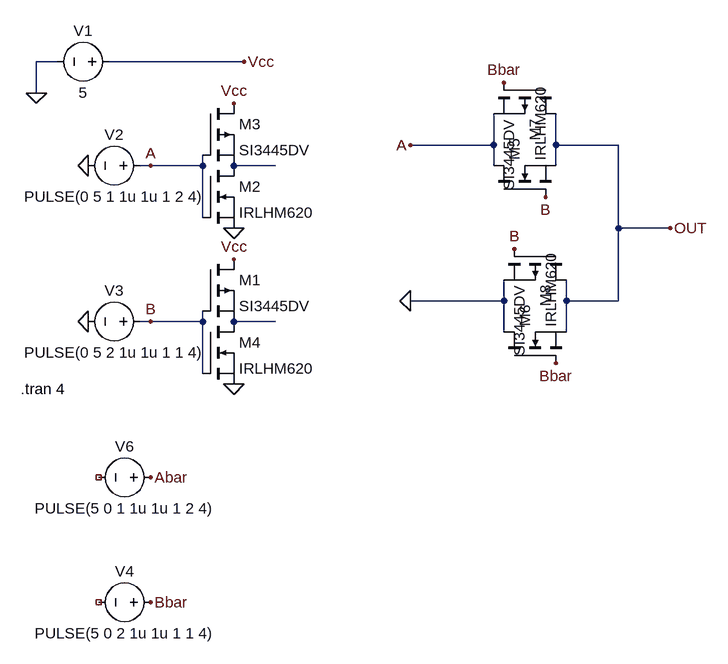
[diagram p0: schematic AND TG.asc]
AND TG.asc, the LTspice schematic file:
Version 4.1
SHEET 1 1444 880
WIRE -128 -16 -160 -16
WIRE 160 -16 -48 -16
WIRE -160 32 -160 -16
WIRE 544 112 544 64
WIRE 544 112 416 112
WIRE 640 112 640 64
WIRE 736 112 640 112
WIRE 16 144 0 144
WIRE 96 144 96 128
WIRE 96 144 16 144
WIRE 208 144 144 144
WIRE 544 144 544 112
WIRE 640 144 640 112
WIRE 96 224 96 144
WIRE 736 240 736 112
WIRE 816 240 736 240
WIRE 560 352 560 320
WIRE 560 352 416 352
WIRE 656 352 656 320
WIRE 736 352 736 240
WIRE 736 352 656 352
WIRE 16 384 0 384
WIRE 96 384 96 368
WIRE 96 384 16 384
WIRE 208 384 144 384
WIRE 560 400 560 352
WIRE 656 400 656 352
WIRE 96 464 96 384
FLAG -160 32 0
FLAG 160 -16 Vcc
FLAG -80 144 0
FLAG -80 384 0
FLAG 144 48 Vcc
FLAG 144 240 0
FLAG 16 144 A
FLAG 16 384 B
FLAG 144 288 Vcc
FLAG 144 480 0
FLAG 16 624 Abar
FLAG 16 816 Bbar
FLAG 560 16 Bbar
FLAG 640 448 Bbar
FLAG 624 192 B
FLAG 576 272 B
FLAG 416 352 0
FLAG 416 112 A
FLAG 816 240 OUT
SYMBOL voltage -32 -16 R90
WINDOW 0 -32 56 VBottom 2
WINDOW 3 32 56 VTop 2
WINDOW 123 0 0 Left 0
WINDOW 39 0 0 Left 0
SYMATTR InstName V1
SYMATTR Value 5
SYMBOL voltage 16 144 R90
WINDOW 0 -32 56 VBottom 2
WINDOW 3 32 56 VTop 2
WINDOW 123 0 0 Left 0
WINDOW 39 0 0 Left 0
SYMATTR InstName V2
SYMATTR Value PULSE(0 5 1 1u 1u 1 2 4)
SYMBOL voltage 16 384 R90
WINDOW 0 -32 56 VBottom 2
WINDOW 3 32 56 VTop 2
WINDOW 123 0 0 Left 0
WINDOW 39 0 0 Left 0
SYMATTR InstName V3
SYMATTR Value PULSE(0 5 2 1u 1u 1 1 4)
SYMBOL pmos 96 48 R0
SYMATTR InstName M3
SYMATTR Value SI3445DV
SYMBOL nmos 96 144 R0
SYMATTR InstName M2
SYMATTR Value IRLHM620
SYMBOL pmos 96 288 R0
SYMATTR InstName M1
SYMATTR Value SI3445DV
SYMBOL nmos 96 384 R0
SYMATTR InstName M4
SYMATTR Value IRLHM620
SYMBOL nmos 544 192 R270
SYMATTR InstName M5
SYMATTR Value IRLHM620
SYMBOL nmos 560 448 R270
SYMATTR InstName M6
SYMATTR Value IRLHM620
SYMBOL pmos 640 16 R90
SYMATTR InstName M7
SYMATTR Value SI3445DV
SYMBOL pmos 656 272 R90
SYMATTR InstName M8
SYMATTR Value SI3445DV
SYMBOL voltage 32 624 R90
WINDOW 0 -32 56 VBottom 2
WINDOW 3 32 56 VTop 2
WINDOW 123 0 0 Left 0
WINDOW 39 0 0 Left 0
SYMATTR InstName V6
SYMATTR Value PULSE(5 0 1 1u 1u 1 2 4)
SYMBOL voltage 32 816 R90
WINDOW 0 -32 56 VBottom 2
WINDOW 3 32 56 VTop 2
WINDOW 123 0 0 Left 0
WINDOW 39 0 0 Left 0
SYMATTR InstName V4
SYMATTR Value PULSE(5 0 2 1u 1u 1 1 4)
TEXT -184 488 Left 2 !.tran 4

The netlist it stands for:
* AND TG.asc
V1 Vcc 0 5
V2 A 0 PULSE(0 5 1 1u 1u 1 2 4)
V3 B 0 PULSE(0 5 2 1u 1u 1 1 4)
M3 Vcc A N001 N001 SI3445DV
M2 N001 A 0 0 IRLHM620
M1 Vcc B N002 N002 SI3445DV
M4 N002 B 0 0 IRLHM620
M5 A B OUT OUT IRLHM620
M6 0 Bbar OUT OUT IRLHM620
M7 OUT Bbar A A SI3445DV
M8 OUT B 0 0 SI3445DV
V6 Abar NC_01 PULSE(5 0 1 1u 1u 1 2 4)
V4 Bbar NC_02 PULSE(5 0 2 1u 1u 1 1 4)
.model NMOS NMOS
.model PMOS PMOS
.lib standard.mos
.tran 4
.backanno
.end